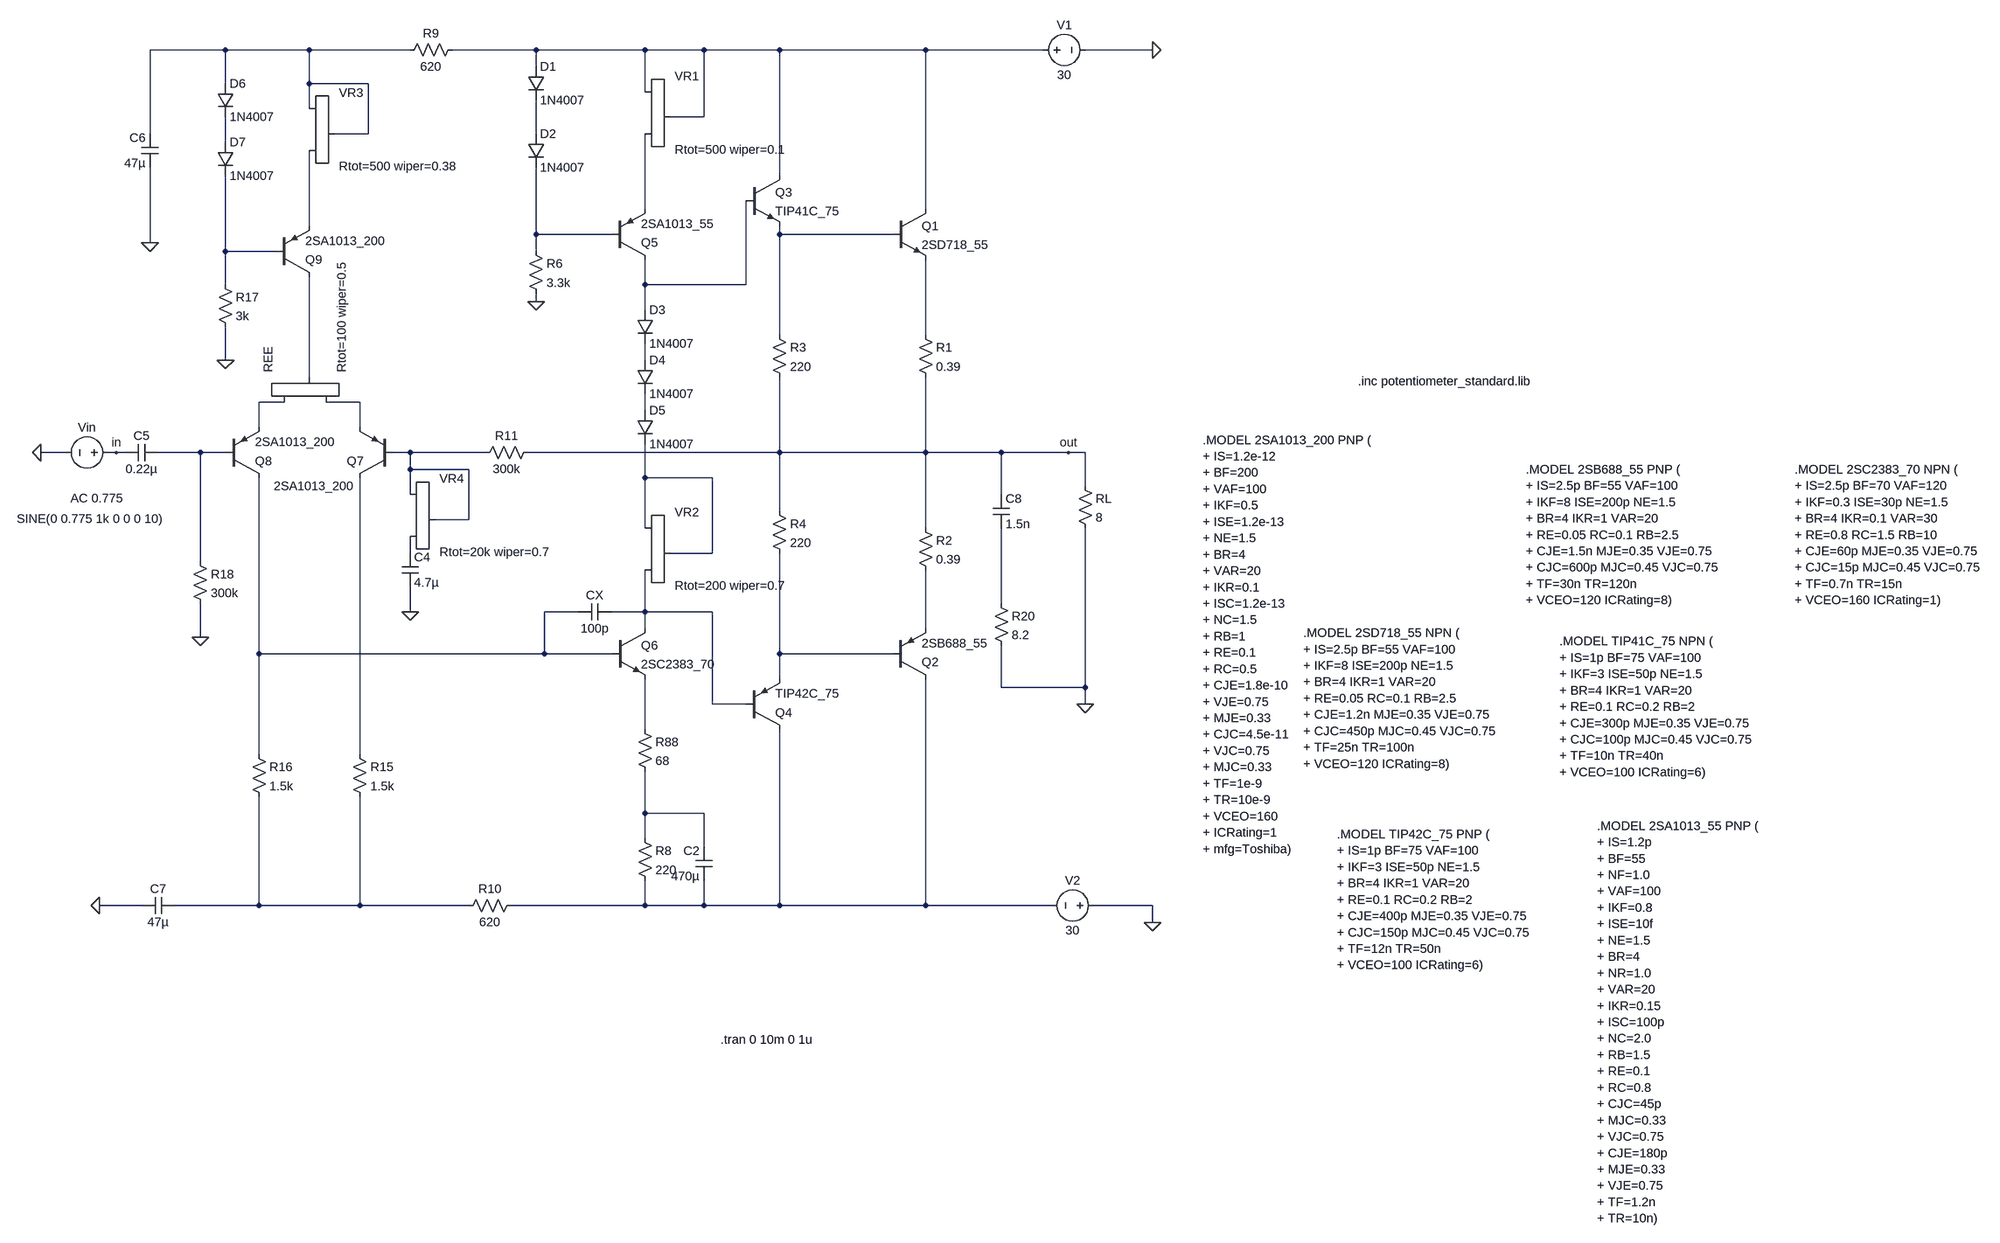
[diagram p0: schematic Draft1.asc]
Draft1.asc, the LTspice schematic file:
Version 4.1
SHEET 1 3976 1732
WIRE -1088 -464 -1232 -464
WIRE -928 -464 -1088 -464
WIRE -736 -464 -928 -464
WIRE -496 -464 -656 -464
WIRE -288 -464 -496 -464
WIRE -176 -464 -288 -464
WIRE -32 -464 -176 -464
WIRE 272 -464 -32 -464
WIRE 496 -464 272 -464
WIRE 704 -464 576 -464
WIRE -496 -432 -496 -464
WIRE -1088 -400 -1088 -464
WIRE -928 -400 -928 -464
WIRE -816 -400 -928 -400
WIRE -288 -384 -288 -464
WIRE -928 -352 -928 -400
WIRE -176 -336 -176 -464
WIRE -176 -336 -240 -336
WIRE -1232 -304 -1232 -464
WIRE -816 -304 -816 -400
WIRE -816 -304 -880 -304
WIRE -496 -304 -496 -368
WIRE -1088 -288 -1088 -336
WIRE -32 -224 -32 -464
WIRE -288 -160 -288 -304
WIRE 272 -160 272 -464
WIRE -928 -128 -928 -272
WIRE -496 -112 -496 -240
WIRE -352 -112 -496 -112
WIRE -32 -112 -32 -128
WIRE 208 -112 -32 -112
WIRE -1232 -96 -1232 -240
WIRE -1088 -80 -1088 -224
WIRE -992 -80 -1088 -80
WIRE -496 -80 -496 -112
WIRE -1088 -16 -1088 -80
WIRE -288 -16 -288 -64
WIRE -96 -16 -96 -176
WIRE -96 -16 -288 -16
WIRE -496 16 -496 0
WIRE -288 32 -288 -16
WIRE -32 80 -32 -112
WIRE 272 80 272 -64
WIRE -1088 128 -1088 64
WIRE -288 128 -288 96
WIRE -928 160 -928 -32
WIRE -976 208 -1024 208
WIRE -832 208 -896 208
WIRE -288 224 -288 192
WIRE -1024 256 -1024 208
WIRE -832 256 -832 208
WIRE -1392 304 -1440 304
WIRE -1296 304 -1312 304
WIRE -1280 304 -1296 304
WIRE -1136 304 -1216 304
WIRE -1088 304 -1136 304
WIRE -736 304 -768 304
WIRE -592 304 -736 304
WIRE -32 304 -32 160
WIRE -32 304 -512 304
WIRE 272 304 272 160
WIRE 272 304 -32 304
WIRE 416 304 272 304
WIRE 544 304 416 304
WIRE 576 304 544 304
WIRE -736 336 -736 304
WIRE -624 336 -736 336
WIRE -288 352 -288 288
WIRE -160 352 -288 352
WIRE 576 368 576 304
WIRE -736 384 -736 336
WIRE 416 384 416 304
WIRE -32 416 -32 304
WIRE -624 432 -624 336
WIRE -624 432 -688 432
WIRE -288 448 -288 352
WIRE 272 448 272 304
WIRE -736 496 -736 464
WIRE -160 496 -160 352
WIRE -160 496 -240 496
WIRE -1136 512 -1136 304
WIRE 416 592 416 448
WIRE -736 608 -736 560
WIRE -416 608 -480 608
WIRE -288 608 -288 528
WIRE -288 608 -352 608
WIRE -160 608 -288 608
WIRE -288 640 -288 608
WIRE 272 640 272 528
WIRE -1136 656 -1136 592
WIRE -1024 688 -1024 352
WIRE -480 688 -480 608
WIRE -480 688 -1024 688
WIRE -352 688 -480 688
WIRE -32 688 -32 496
WIRE 208 688 -32 688
WIRE -32 736 -32 688
WIRE 416 752 416 672
WIRE 576 752 576 448
WIRE 576 752 416 752
WIRE -160 784 -160 608
WIRE -96 784 -160 784
WIRE 576 784 576 752
WIRE -288 832 -288 736
WIRE -1024 880 -1024 688
WIRE -832 880 -832 352
WIRE -288 992 -288 912
WIRE -176 992 -288 992
WIRE -288 1040 -288 992
WIRE -176 1056 -176 992
WIRE -1248 1168 -1328 1168
WIRE -1024 1168 -1024 960
WIRE -1024 1168 -1184 1168
WIRE -832 1168 -832 960
WIRE -832 1168 -1024 1168
WIRE -624 1168 -832 1168
WIRE -288 1168 -288 1120
WIRE -288 1168 -544 1168
WIRE -176 1168 -176 1120
WIRE -176 1168 -288 1168
WIRE -32 1168 -32 832
WIRE -32 1168 -176 1168
WIRE 272 1168 272 736
WIRE 272 1168 -32 1168
WIRE 512 1168 272 1168
WIRE 704 1168 592 1168
WIRE 704 1200 704 1168
FLAG -496 16 0
FLAG -1136 656 0
FLAG -736 608 0
FLAG -1088 128 0
FLAG -1232 -96 0
FLAG -1328 1168 0
FLAG 704 1200 0
FLAG -1296 304 in
FLAG 544 304 out
FLAG 576 784 0
FLAG -1440 304 0
FLAG 704 -464 0
DATAFLAG 352 304 ""
SYMBOL npn 208 -160 R0
SYMATTR InstName Q1
SYMATTR Value 2SD718_55
SYMBOL pnp 208 736 M180
SYMATTR InstName Q2
SYMATTR Value 2SB688_55
SYMBOL res 256 64 R0
SYMATTR InstName R1
SYMATTR Value 0.39
SYMBOL res 256 432 R0
SYMATTR InstName R2
SYMATTR Value 0.39
SYMBOL res -48 64 R0
SYMATTR InstName R3
SYMATTR Value 220
SYMBOL res -48 400 R0
SYMATTR InstName R4
SYMATTR Value 220
SYMBOL npn -96 -224 R0
SYMATTR InstName Q3
SYMATTR Value TIP41C_75
SYMBOL pnp -96 832 M180
SYMATTR InstName Q4
SYMATTR Value TIP42C_75
SYMBOL npn -352 640 R0
SYMATTR InstName Q6
SYMATTR Value 2SC2383_70
SYMBOL pnp -352 -64 M180
SYMATTR InstName Q5
SYMATTR Value 2SA1013_55
SYMBOL res -640 -480 R90
WINDOW 0 0 56 VBottom 2
WINDOW 3 32 56 VTop 2
SYMATTR InstName R9
SYMATTR Value 620
SYMBOL pnp -768 352 R180
WINDOW 3 75 -16 Left 2
SYMATTR InstName Q7
SYMATTR Value 2SA1013_200
SYMBOL pnp -1088 352 M180
SYMATTR InstName Q8
SYMATTR Value 2SA1013_200
SYMBOL diode -512 -432 R0
SYMATTR InstName D1
SYMATTR Value 1N4007
SYMBOL diode -512 -304 R0
SYMATTR InstName D2
SYMATTR Value 1N4007
SYMBOL diode -304 32 R0
SYMATTR InstName D3
SYMATTR Value 1N4007
SYMBOL diode -304 128 R0
SYMATTR InstName D4
SYMATTR Value 1N4007
SYMBOL diode -304 224 R0
SYMATTR InstName D5
SYMATTR Value 1N4007
SYMBOL pnp -992 -32 M180
SYMATTR InstName Q9
SYMATTR Value 2SA1013_200
SYMBOL diode -1104 -400 R0
SYMATTR InstName D6
SYMATTR Value 1N4007
SYMBOL diode -1104 -288 R0
SYMATTR InstName D7
SYMATTR Value 1N4007
SYMBOL potentiometer_standard -304 -400 R0
SYMATTR InstName VR1
SYMATTR Value Rtot=500 wiper=0.1
SYMATTR SpiceLine ""
SYMBOL potentiometer_standard -304 432 R0
SYMATTR InstName VR2
SYMATTR Value Rtot=200 wiper=0.7
SYMATTR SpiceLine ""
SYMBOL potentiometer_standard -944 -368 R0
SYMATTR InstName VR3
SYMATTR Value Rtot=500 wiper=0.38
SYMATTR SpiceLine ""
SYMBOL potentiometer_standard -752 368 R0
SYMATTR InstName VR4
SYMATTR Value Rtot=20k wiper=0.7
SYMATTR SpiceLine ""
SYMBOL potentiometer_standard -992 224 R270
SYMATTR InstName REE
SYMATTR Value Rtot=100 wiper=0.5
SYMATTR SpiceLine ""
SYMBOL res -496 288 R90
WINDOW 0 0 56 VBottom 2
WINDOW 3 32 56 VTop 2
SYMATTR InstName R11
SYMATTR Value 300k
SYMBOL res -640 1184 R270
WINDOW 0 32 56 VTop 2
WINDOW 3 0 56 VBottom 2
SYMATTR InstName R10
SYMATTR Value 620
SYMBOL res -848 864 R0
SYMATTR InstName R15
SYMATTR Value 1.5k
SYMBOL res -1040 864 R0
SYMATTR InstName R16
SYMATTR Value 1.5k
SYMBOL res -1152 496 R0
SYMATTR InstName R18
SYMATTR Value 300k
SYMBOL res -1104 -32 R0
SYMATTR InstName R17
SYMATTR Value 3k
SYMBOL res 400 576 R0
SYMATTR InstName R20
SYMATTR Value 8.2
SYMBOL res 560 352 R0
SYMATTR InstName RL
SYMATTR Value 8
SYMBOL cap -160 1120 R180
WINDOW 0 24 56 Left 2
WINDOW 3 24 8 Left 2
SYMATTR InstName C2
SYMATTR Value 470µ
SYMBOL cap -752 496 R0
SYMATTR InstName C4
SYMATTR Value 4.7µ
SYMBOL cap -1216 288 R90
WINDOW 0 0 32 VBottom 2
WINDOW 3 32 32 VTop 2
SYMATTR InstName C5
SYMATTR Value 0.22µ
SYMBOL cap -1216 -240 R180
WINDOW 0 24 56 Left 2
WINDOW 3 24 8 Left 2
SYMATTR InstName C6
SYMATTR Value 47µ
SYMBOL cap -1248 1184 R270
WINDOW 0 32 32 VTop 2
WINDOW 3 0 32 VBottom 2
SYMATTR InstName C7
SYMATTR Value 47µ
SYMBOL res -304 1024 R0
SYMATTR InstName R8
SYMATTR Value 220
SYMBOL res -304 816 R0
SYMATTR InstName R88
SYMATTR Value 68
SYMBOL res -512 -96 R0
SYMATTR InstName R6
SYMATTR Value 3.3k
SYMBOL voltage 480 -464 R270
WINDOW 0 32 56 VTop 2
WINDOW 3 -32 56 VBottom 2
WINDOW 123 4 56 VTop 2
WINDOW 39 0 0 Left 0
SYMATTR InstName V1
SYMATTR Value 30
SYMBOL voltage 608 1168 R90
WINDOW 0 -32 56 VBottom 2
WINDOW 3 32 56 VTop 2
WINDOW 123 60 56 VTop 2
WINDOW 39 0 0 Left 0
SYMATTR InstName V2
SYMATTR Value 30
SYMBOL cap 400 384 R0
SYMATTR InstName C8
SYMATTR Value 1.5n
SYMBOL cap -352 592 R90
WINDOW 0 0 32 VBottom 2
WINDOW 3 32 32 VTop 2
SYMATTR InstName CX
SYMATTR Value 100p
SYMBOL voltage -1296 304 R90
WINDOW 0 -32 56 VBottom 2
WINDOW 3 111 50 VTop 2
WINDOW 123 72 37 VTop 2
WINDOW 39 0 0 Left 0
SYMATTR InstName Vin
SYMATTR Value SINE(0 0.775 1k 0 0 0 10)
SYMATTR Value2 AC 0.775
TEXT 1096 168 Left 2 !.inc potentiometer_standard.lib
TEXT 800 280 Left 2 !.MODEL 2SA1013_200 PNP (\n+ IS=1.2e-12 \n+ BF=200 \n+ VAF=100 \n+ IKF=0.5 \n+ ISE=1.2e-13 \n+ NE=1.5 \n+ BR=4 \n+ VAR=20 \n+ IKR=0.1 \n+ ISC=1.2e-13 \n+ NC=1.5 \n+ RB=1 \n+ RE=0.1 \n+ RC=0.5 \n+ CJE=1.8e-10 \n+ VJE=0.75 \n+ MJE=0.33 \n+ CJC=4.5e-11 \n+ VJC=0.75 \n+ MJC=0.33 \n+ TF=1e-9 \n+ TR=10e-9 \n+ VCEO=160 \n+ ICRating=1 \n+ mfg=Toshiba)
TEXT 992 648 Left 2 !.MODEL 2SD718_55 NPN (\n+ IS=2.5p BF=55 VAF=100 \n+ IKF=8 ISE=200p NE=1.5 \n+ BR=4 IKR=1 VAR=20 \n+ RE=0.05 RC=0.1 RB=2.5 \n+ CJE=1.2n MJE=0.35 VJE=0.75 \n+ CJC=450p MJC=0.45 VJC=0.75 \n+ TF=25n TR=100n \n+ VCEO=120 ICRating=8)
TEXT 1416 336 Left 2 !.MODEL 2SB688_55 PNP (\n+ IS=2.5p BF=55 VAF=100 \n+ IKF=8 ISE=200p NE=1.5 \n+ BR=4 IKR=1 VAR=20 \n+ RE=0.05 RC=0.1 RB=2.5 \n+ CJE=1.5n MJE=0.35 VJE=0.75 \n+ CJC=600p MJC=0.45 VJC=0.75 \n+ TF=30n TR=120n \n+ VCEO=120 ICRating=8)
TEXT 1480 664 Left 2 !.MODEL TIP41C_75 NPN (\n+ IS=1p BF=75 VAF=100 \n+ IKF=3 ISE=50p NE=1.5 \n+ BR=4 IKR=1 VAR=20 \n+ RE=0.1 RC=0.2 RB=2 \n+ CJE=300p MJE=0.35 VJE=0.75 \n+ CJC=100p MJC=0.45 VJC=0.75 \n+ TF=10n TR=40n \n+ VCEO=100 ICRating=6)
TEXT 1056 1032 Left 2 !.MODEL TIP42C_75 PNP (\n+ IS=1p BF=75 VAF=100 \n+ IKF=3 ISE=50p NE=1.5 \n+ BR=4 IKR=1 VAR=20 \n+ RE=0.1 RC=0.2 RB=2 \n+ CJE=400p MJE=0.35 VJE=0.75 \n+ CJC=150p MJC=0.45 VJC=0.75 \n+ TF=12n TR=50n \n+ VCEO=100 ICRating=6)
TEXT 1552 1016 Left 2 !.MODEL 2SA1013_55 PNP (\n+ IS=1.2p       \n+ BF=55         \n+ NF=1.0        \n+ VAF=100       \n+ IKF=0.8       \n+ ISE=10f       \n+ NE=1.5        \n+ BR=4          \n+ NR=1.0        \n+ VAR=20        \n+ IKR=0.15      \n+ ISC=100p      \n+ NC=2.0        \n+ RB=1.5        \n+ RE=0.1        \n+ RC=0.8        \n+ CJC=45p       \n+ MJC=0.33      \n+ VJC=0.75      \n+ CJE=180p      \n+ MJE=0.33      \n+ VJE=0.75      \n+ TF=1.2n       \n+ TR=10n)
TEXT 1928 336 Left 2 !.MODEL 2SC2383_70 NPN (\n+ IS=2.5p BF=70 VAF=120 \n+ IKF=0.3 ISE=30p NE=1.5 \n+ BR=4 IKR=0.1 VAR=30 \n+ RE=0.8 RC=1.5 RB=10 \n+ CJE=60p MJE=0.35 VJE=0.75 \n+ CJC=15p MJC=0.45 VJC=0.75 \n+ TF=0.7n TR=15n \n+ VCEO=160 ICRating=1)
TEXT -144 1424 Left 2 !.tran 0 10m 0 1u

The netlist it stands for:
* Draft1.asc
Q1 N002 N008 N011 0 2SD718_55
Q2 N030 N025 N024 0 2SB688_55
R1 N011 out 0.39
R2 out N024 0.39
R3 N008 out 220
R4 out N025 220
Q3 N002 N010 N008 0 TIP41C_75
Q4 N030 N023 N025 0 TIP42C_75
Q6 N023 N022 N026 0 2SC2383_70
Q5 N010 N007 N005 0 2SA1013_55
R9 N002 N001 620
Q7 N027 N018 N015 0 2SA1013_200
Q8 N022 N017 N014 0 2SA1013_200
D1 N002 N003 1N4007
D2 N003 N007 1N4007
D3 N010 N012 1N4007
D4 N012 N016 1N4007
D5 N016 N019 1N4007
Q9 N013 N009 N006 0 2SA1013_200
D6 N001 N004 1N4007
D7 N004 N009 1N4007
X§VR1 N002 N005 N002 Rtot=500 wiper=0.1
X§VR2 N019 N023 N019 Rtot=200 wiper=0.7
X§VR3 N001 N006 N001 Rtot=500 wiper=0.38
X§VR4 N018 N020 N018 Rtot=20k wiper=0.7
X§REE N014 N015 N013 Rtot=100 wiper=0.5
R11 out N018 300k
R10 N029 N030 620
R15 N027 N029 1.5k
R16 N022 N029 1.5k
R18 N017 0 300k
R17 N009 0 3k
R20 N021 0 8.2
RL out 0 8
C2 N030 N028 470µ
C4 N020 0 4.7µ
C5 N017 in 0.22µ
C6 0 N001 47µ
C7 0 N029 47µ
R8 N028 N030 220
R88 N026 N028 68
R6 N007 0 3.3k
V1 N002 0 30
V2 0 N030 30
C8 out N021 1.5n
CX N023 N022 100p
Vin in 0 SINE(0 0.775 1k 0 0 0 10) AC 0.775
.model D D
.lib standard.dio
.model NPN NPN
.model PNP PNP
.lib standard.bjt
.inc potentiometer_standard.lib
.MODEL 2SA1013_200 PNP (
+ IS=1.2e-12
+ BF=200
+ VAF=100
+ IKF=0.5
+ ISE=1.2e-13
+ NE=1.5
+ BR=4
+ VAR=20
+ IKR=0.1
+ ISC=1.2e-13
+ NC=1.5
+ RB=1
+ RE=0.1
+ RC=0.5
+ CJE=1.8e-10
+ VJE=0.75
+ MJE=0.33
+ CJC=4.5e-11
+ VJC=0.75
+ MJC=0.33
+ TF=1e-9
+ TR=10e-9
+ VCEO=160
+ ICRating=1
+ mfg=Toshiba)
.MODEL 2SD718_55 NPN (
+ IS=2.5p BF=55 VAF=100
+ IKF=8 ISE=200p NE=1.5
+ BR=4 IKR=1 VAR=20
+ RE=0.05 RC=0.1 RB=2.5
+ CJE=1.2n MJE=0.35 VJE=0.75
+ CJC=450p MJC=0.45 VJC=0.75
+ TF=25n TR=100n
+ VCEO=120 ICRating=8)
.MODEL 2SB688_55 PNP (
+ IS=2.5p BF=55 VAF=100
+ IKF=8 ISE=200p NE=1.5
+ BR=4 IKR=1 VAR=20
+ RE=0.05 RC=0.1 RB=2.5
+ CJE=1.5n MJE=0.35 VJE=0.75
+ CJC=600p MJC=0.45 VJC=0.75
+ TF=30n TR=120n
+ VCEO=120 ICRating=8)
.MODEL TIP41C_75 NPN (
+ IS=1p BF=75 VAF=100
+ IKF=3 ISE=50p NE=1.5
+ BR=4 IKR=1 VAR=20
+ RE=0.1 RC=0.2 RB=2
+ CJE=300p MJE=0.35 VJE=0.75
+ CJC=100p MJC=0.45 VJC=0.75
+ TF=10n TR=40n
+ VCEO=100 ICRating=6)
.MODEL TIP42C_75 PNP (
+ IS=1p BF=75 VAF=100
+ IKF=3 ISE=50p NE=1.5
+ BR=4 IKR=1 VAR=20
+ RE=0.1 RC=0.2 RB=2
+ CJE=400p MJE=0.35 VJE=0.75
+ CJC=150p MJC=0.45 VJC=0.75
+ TF=12n TR=50n
+ VCEO=100 ICRating=6)
.MODEL 2SA1013_55 PNP (
+ IS=1.2p
+ BF=55
+ NF=1.0
+ VAF=100
+ IKF=0.8
+ ISE=10f
+ NE=1.5
+ BR=4
+ NR=1.0
+ VAR=20
+ IKR=0.15
+ ISC=100p
+ NC=2.0
+ RB=1.5
+ RE=0.1
+ RC=0.8
+ CJC=45p
+ MJC=0.33
+ VJC=0.75
+ CJE=180p
+ MJE=0.33
+ VJE=0.75
+ TF=1.2n
+ TR=10n)
.MODEL 2SC2383_70 NPN (
+ IS=2.5p BF=70 VAF=120
+ IKF=0.3 ISE=30p NE=1.5
+ BR=4 IKR=0.1 VAR=30
+ RE=0.8 RC=1.5 RB=10
+ CJE=60p MJE=0.35 VJE=0.75
+ CJC=15p MJC=0.45 VJC=0.75
+ TF=0.7n TR=15n
+ VCEO=160 ICRating=1)
.tran 0 10m 0 1u
.backanno
.end